# Altium project WatchX-change.PrjPCB
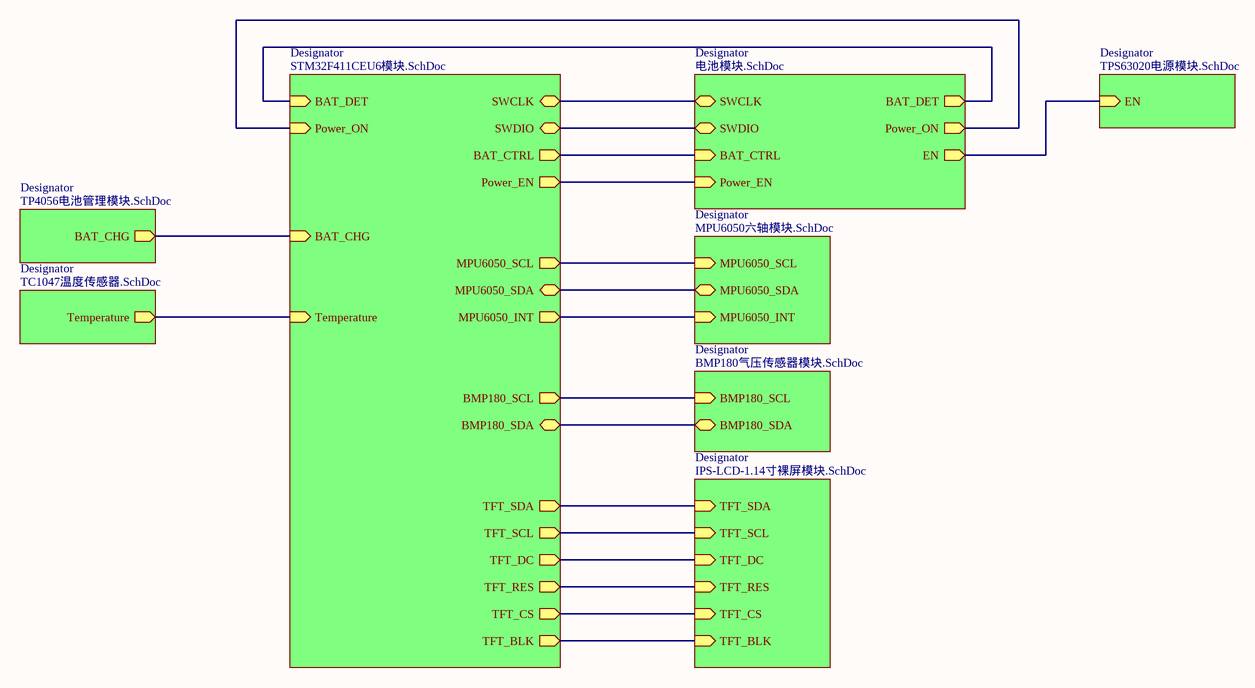
[diagram p0: WatchX-change.SchDoc]
9 sheets, 83 parts. Net scope: hierarchical (ports join the sheet entries above them; power ports are global).
Sheets:
  WatchX-change.SchDoc
    Designator = BMP180气压传感器模块.SchDoc
    Designator = IPS-LCD-1.14寸裸屏模块.SchDoc
    Designator = MPU6050六轴模块.SchDoc
    Designator = STM32F411CEU6模块.SchDoc
    Designator = TP4056电池管理模块.SchDoc
    Designator = TPS63020电源模块.SchDoc
    Designator = TC1047温度传感器.SchDoc
    Designator = 电池模块.SchDoc

## Sheet WatchX-change.SchDoc
size A4

### Sub-sheets
Designator = BMP180气压传感器模块.SchDoc: BMP180_SCL (in), BMP180_SDA (bidir)
Designator = IPS-LCD-1.14寸裸屏模块.SchDoc: TFT_SDA (in), TFT_SCL (in), TFT_DC (in), TFT_RES (in), TFT_CS (in), TFT_BLK (in)
Designator = MPU6050六轴模块.SchDoc: MPU6050_SCL (in), MPU6050_SDA (bidir), MPU6050_INT (in)
Designator = STM32F411CEU6模块.SchDoc: BMP180_SCL (out), BMP180_SDA (bidir), Temperature (in), Power_ON (in), Power_EN (out), MPU6050_SCL (out), MPU6050_SDA (bidir), MPU6050_INT (out), TFT_SDA (out), TFT_SCL (out), TFT_DC (out), TFT_RES (out), TFT_CS (out), TFT_BLK (out), BAT_DET (in), BAT_CHG (in), BAT_CTRL (out), SWCLK (bidir), SWDIO (bidir)
Designator = TP4056电池管理模块.SchDoc: BAT_CHG (out)
Designator = TPS63020电源模块.SchDoc: EN (in)
Designator = TC1047温度传感器.SchDoc: Temperature (out)
Designator = 电池模块.SchDoc: SWCLK (bidir), SWDIO (bidir), BAT_DET (out), BAT_CTRL (in), Power_ON (out), Power_EN (in), EN (out)

### Nets
BAT_CHG: sheet Designator/BAT_CHG, sheet Designator/BAT_CHG
BAT_CTRL: sheet Designator/BAT_CTRL, sheet Designator/BAT_CTRL
BAT_DET: sheet Designator/BAT_DET, sheet Designator/BAT_DET
BMP180_SCL: sheet Designator/BMP180_SCL, sheet Designator/BMP180_SCL
BMP180_SDA: sheet Designator/BMP180_SDA, sheet Designator/BMP180_SDA
EN: sheet Designator/EN, sheet Designator/EN
MPU6050_INT: sheet Designator/MPU6050_INT, sheet Designator/MPU6050_INT
MPU6050_SCL: sheet Designator/MPU6050_SCL, sheet Designator/MPU6050_SCL
MPU6050_SDA: sheet Designator/MPU6050_SDA, sheet Designator/MPU6050_SDA
Power_EN: sheet Designator/Power_EN, sheet Designator/Power_EN
Power_ON: sheet Designator/Power_ON, sheet Designator/Power_ON
SWCLK: sheet Designator/SWCLK, sheet Designator/SWCLK
SWDIO: sheet Designator/SWDIO, sheet Designator/SWDIO
Temperature: sheet Designator/Temperature, sheet Designator/Temperature
TFT_BLK: sheet Designator/TFT_BLK, sheet Designator/TFT_BLK
TFT_CS: sheet Designator/TFT_CS, sheet Designator/TFT_CS
TFT_DC: sheet Designator/TFT_DC, sheet Designator/TFT_DC
TFT_RES: sheet Designator/TFT_RES, sheet Designator/TFT_RES
TFT_SCL: sheet Designator/TFT_SCL, sheet Designator/TFT_SCL
TFT_SDA: sheet Designator/TFT_SDA, sheet Designator/TFT_SDA

## Sheet BMP180气压传感器模块.SchDoc
size A4
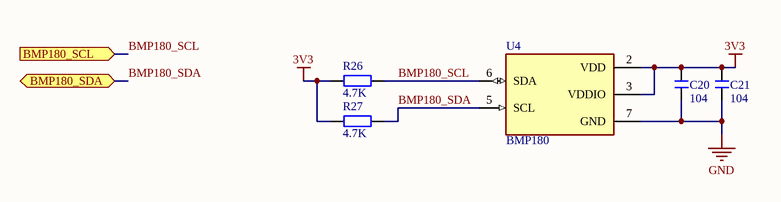
[diagram p1: BMP180气压传感器模块.SchDoc]

### Parts
C20  104  [C 0603_L]
C21  104  [C 0603_L]
R26  4.7K  [R 0603_L]
R27  4.7K  [R 0603_L]
U4  BMP180  [LGA-7]

### Ports
BMP180_SCL (in), BMP180_SDA (bidir)

### Nets
3V3: C20.2 C21.2 R26.2 R27.2 U4.2(VDD) U4.3(VDDIO)
GND: C20.1 C21.1 U4.7(GND)
BMP180_SCL: R26.1 U4.6(SDA) ; port BMP180_SCL
BMP180_SDA: R27.1 U4.5(SCL) ; port BMP180_SDA

### Library data of the parts
C20 C21 = C: 无极性贴片电容; 版权归属: 黎明电子style; BOM名称: 无极性贴片电容; 学习资源: https://lmdzstyle.taobao.com/
R26 R27 = R: 贴片电阻; 版权归属: 黎明电子style; BOM名称: 贴片电阻; 学习资源: https://lmdzstyle.taobao.com/
U4 = BMP180: 气压传感器Pressure Sensor 4.35PSI ~ 15.95PSI _30kPa ~ 110kPa_ Absolute 16 ~ 19 b 7-VLGA; MF: Bosch Sensortec; Digi-Key_Purchase_URL: https://www.digikey.com/product-detail/en/bosch-sensortec/BMP180/828-1027-1-ND/2688260?utm_source=snapeda&utm_medium=aggregator&utm_campaign=symbol; Digi-Key_Part_Number: 828-1027-1-ND; Package: VLGA-7 Bosch Sensortec; SnapEDA_Link: https://www.snapeda.com/parts/BMP180/Bosch%20Sensortec/view-part/587596/?ref=snap; Value: *; MP: BMP180

## Sheet IPS-LCD-1.14寸裸屏模块.SchDoc
size A4
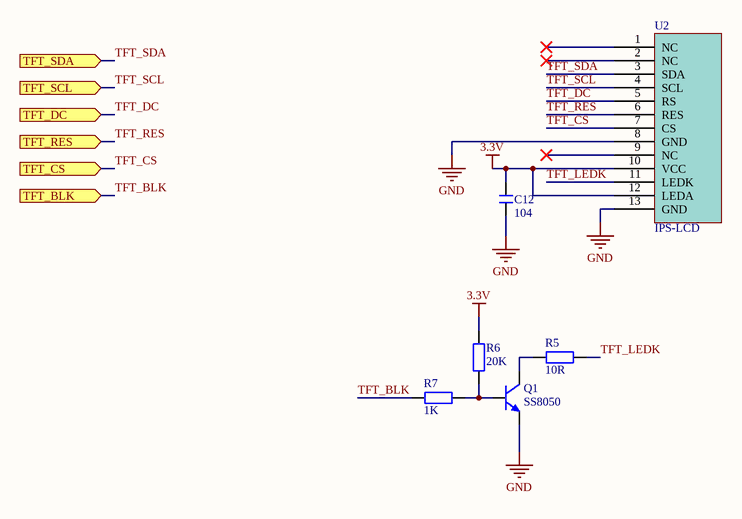
[diagram p2: IPS-LCD-1.14寸裸屏模块.SchDoc]

### Parts
C12  104  [C 0603_L]
Q1  SS8050  [SOT23-3N]
R5  10R  [R 0603_L]
R6  20K  [R 0603_L]
R7  1K  [R 0603_L]
U2  IPS-LCD  [1.14IPS-LCD]

### Ports
TFT_BLK (in), TFT_CS (in), TFT_DC (in), TFT_RES (in), TFT_SCL (in), TFT_SDA (in)

### Nets
3.3V: C12.1 R6.2 U2.10(VCC) U2.12(LEDA)
GND: C12.2 Q1.2(E) U2.8(GND) U2.13(GND)
TFT_BLK: R7.1 ; port TFT_BLK
TFT_CS: U2.7(CS) ; port TFT_CS
TFT_DC: U2.5(RS) ; port TFT_DC
TFT_LEDK: R5.1 U2.11(LEDK)
TFT_RES: U2.6(RES) ; port TFT_RES
TFT_SCL: U2.4(SCL) ; port TFT_SCL
TFT_SDA: U2.3(SDA) ; port TFT_SDA
NetQ1_1: Q1.1(B) R6.1 R7.2
NetQ1_3: Q1.3(C) R5.2

Not connected (* = marked no-connect by the designer): U2 1(NC)* 2(NC)* 9(NC)*

### Library data of the parts
C12 = C: 无极性贴片电容; 版权归属: 黎明电子style; BOM名称: 无极性贴片电容; 学习资源: https://lmdzstyle.taobao.com/
Q1 = 8050-SMD: 高频放大-NPN型 丝印J3Y; 版权归属: 源创客; 属性: 40V 1.5A 1W 100MHZ; BOM名称: 高频放大-NPN型; 学习资源: www.ooocke.com
R5-R7 = R: 贴片电阻; 版权归属: 黎明电子style; BOM名称: 贴片电阻; 学习资源: https://lmdzstyle.taobao.com/
U2 = IPS-LCD-1.14: IPS-LCD-1.14寸裸屏spi接口

## Sheet MPU6050六轴模块.SchDoc
size A4
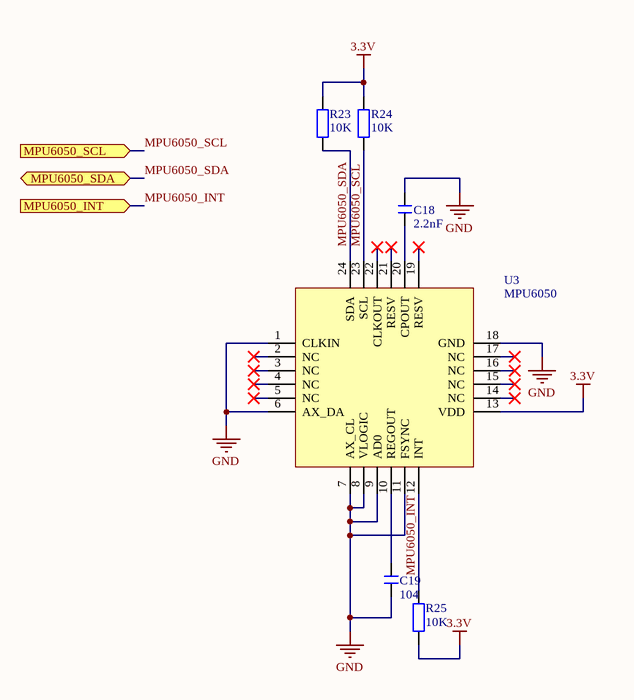
[diagram p3: MPU6050六轴模块.SchDoc]

### Parts
C18  2.2nF  [C 0603_L]
C19  104  [C 0603_L]
R23  10K  [R 0603_L]
R24  10K  [R 0603_L]
R25  10K  [R 0603_L]
U3  MPU6050  [QFN24 4x4_L]

### Ports
MPU6050_INT (in), MPU6050_SCL (in), MPU6050_SDA (bidir)

### Nets
3.3V: R23.2 R24.2 R25.1 U3.13(VDD)
GND: C18.2 C19.1 U3.1(CLKIN) U3.6(AX_DA) U3.7(AX_CL) U3.8(VLOGIC) U3.9(AD0) U3.11(FSYNC) U3.18(GND)
MPU6050_INT: R25.2 U3.12(INT) ; port MPU6050_INT
MPU6050_SCL: R24.1 U3.23(SCL) ; port MPU6050_SCL
MPU6050_SDA: R23.1 U3.24(SDA) ; port MPU6050_SDA
NetC18_1: C18.1 U3.20(CPOUT)
NetC19_2: C19.2 U3.10(REGOUT)

Not connected (* = marked no-connect by the designer): U3 2(NC)* 3(NC)* 4(NC)* 5(NC)* 14(NC)* 15(NC)* 16(NC)* 17(NC)* 19(RESV)* 21(RESV)* 22(CLKOUT)*

### Library data of the parts
C18 C19 = C: 无极性贴片电容; 版权归属: 黎明电子style; BOM名称: 无极性贴片电容; 学习资源: https://lmdzstyle.taobao.com/
R23-R25 = R: 贴片电阻; 版权归属: 黎明电子style; BOM名称: 贴片电阻; 学习资源: https://lmdzstyle.taobao.com/
U3 = MPU6050: 数字运动传感器; 版权归属: 源创客; BOM名称: 数字运动传感器; 学习资源: www.ooocke.com

## Sheet STM32F411CEU6模块.SchDoc
size A4
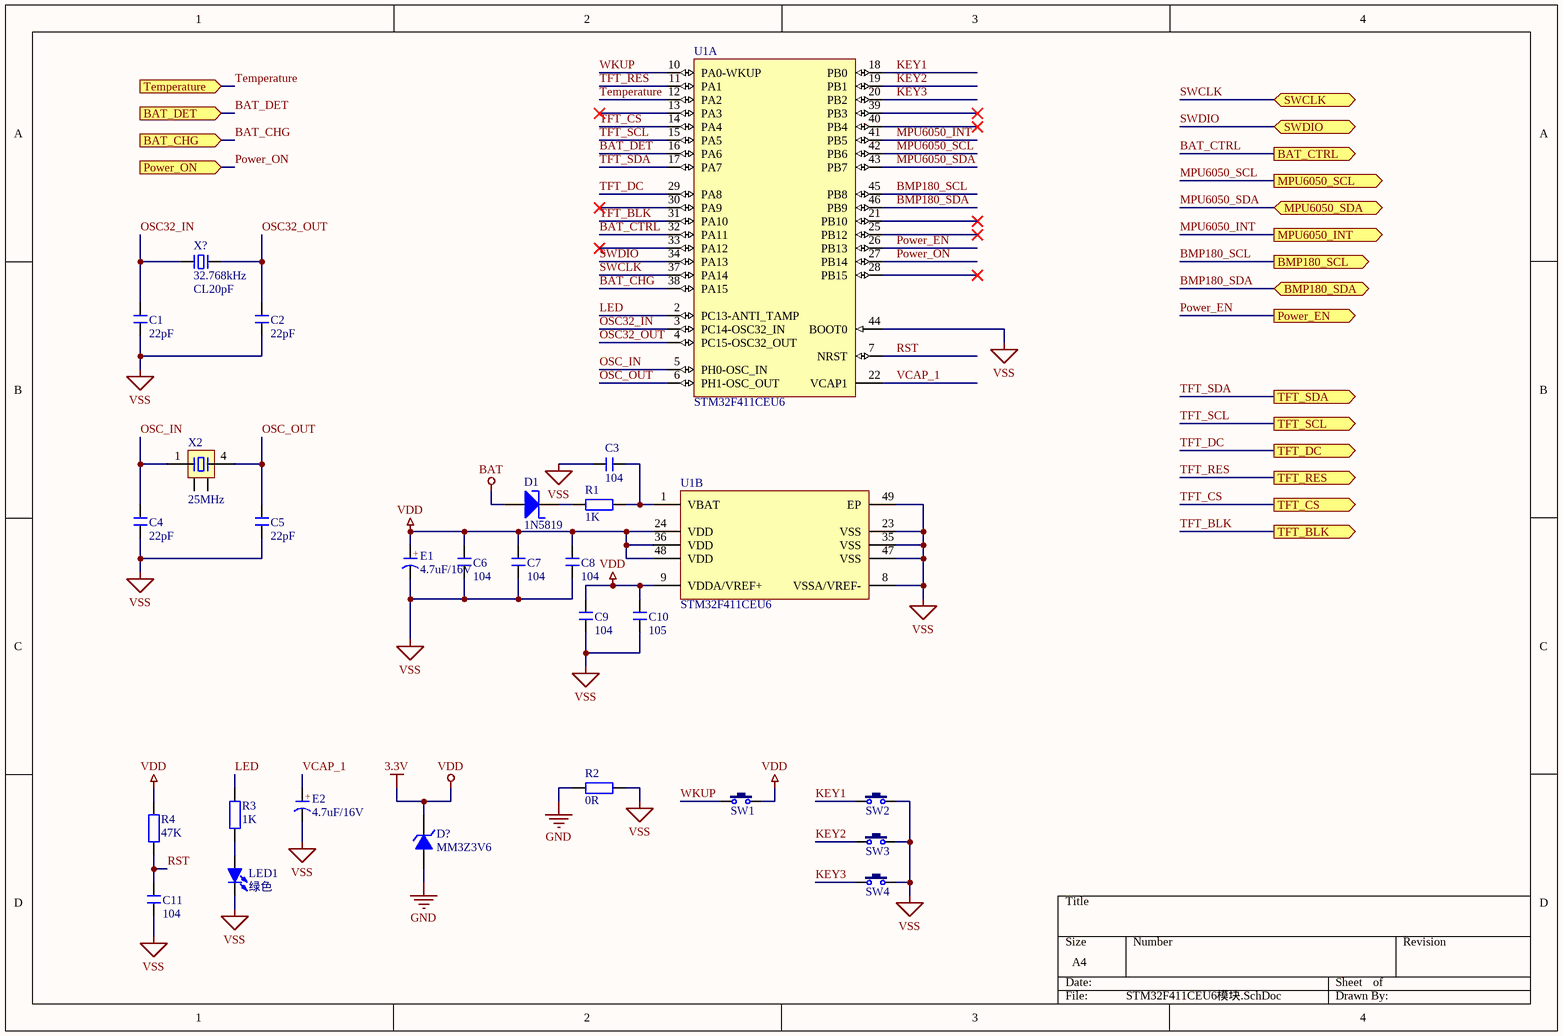
[diagram p4: STM32F411CEU6模块.SchDoc]

### Parts
C1  22pF  [C 0402_M]
C2  22pF  [C 0402_M]
C3  104  [C 0603_L]
C4  22pF  [C 0402_M]
C5  22pF  [C 0402_M]
C6  104  [C 0603_L]
C7  104  [C 0603_L]
C8  104  [C 0603_L]
C9  104  [C 0603_L]
C10  105  [C 0402_M]
C11  104  [C 0603_L]
D1  1N5819  [SOD-323]
D?  MM3Z3V6  [SOD-323]
E1  4.7uF/16V  [CD A(3216)]
E2  4.7uF/16V  [CD A(3216)]
LED1  绿色  [LED 0603G]
R1  1K  [R 0603_L]
R2  0R  [R 0603_L]
R3  1K  [R 0603_L]
R4  47K  [R 0603_L]
SW1  3x6x5  [TSW 3*6*4.3-S-W]  (value not drawn)
SW2  3x6x5  [TSW 3*6*4.3-S-W]  (value not drawn)
SW3  3x6x5  [TSW 3*6*4.3-S-W]  (value not drawn)
SW4  3x6x5  [TSW 3*6*4.3-S-W]  (value not drawn)
U1  STM32F411CEU6  [QFN48 7X7_N]  (parts A,B of 2)
X2  25MHz  [OSC 1612-4P]
X?  32.768kHz  负载电容: CL20pF  [OSC 1016-2P]

### Ports
BAT_CHG (in), BAT_CTRL (out), BAT_DET (in), BMP180_SCL (out), BMP180_SDA (bidir), MPU6050_INT (out), MPU6050_SCL (out), MPU6050_SDA (bidir), Power_EN (out), Power_ON (in), SWCLK (bidir), SWDIO (bidir), Temperature (in), TFT_BLK (out), TFT_CS (out), TFT_DC (out), TFT_RES (out), TFT_SCL (out), TFT_SDA (out)

### Nets
3.3V: C6.2 C7.2 C8.2 C9.2 C10.2 D?.2(K) E1.1(A) R4.2 SW1.2 U1.9(VDDA/VREF+) U1.24(VDD) U1.36(VDD) U1.48(VDD)  [also labelled VDD]
BAT: D1.1(A)
GND: D?.1(A) R2.2
VSS: C1.1 C2.1 C3.2 C4.1 C5.1 C6.1 C7.1 C8.1 C9.1 C10.1 C11.1 E1.2(K) E2.2(K) LED1.2(K) R2.1 SW2.2 SW3.2 SW4.2 U1.8(VSSA/VREF-) U1.23(VSS) U1.35(VSS) U1.44(BOOT0) U1.47(VSS) U1.49(EP)
BAT_CHG: U1.38(PA15) ; port BAT_CHG
BAT_CTRL: U1.32(PA11) ; port BAT_CTRL
BAT_DET: U1.16(PA6) ; port BAT_DET
BMP180_SCL: U1.45(PB8) ; port BMP180_SCL
BMP180_SDA: U1.46(PB9) ; port BMP180_SDA
KEY1: SW2.1 U1.18(PB0)
KEY2: SW3.1 U1.19(PB1)
KEY3: SW4.1 U1.20(PB2)
LED: R3.2 U1.2(PC13-ANTI_TAMP)
MPU6050_INT: U1.41(PB5) ; port MPU6050_INT
MPU6050_SCL: U1.42(PB6) ; port MPU6050_SCL
MPU6050_SDA: U1.43(PB7) ; port MPU6050_SDA
OSC32_IN: C1.2 U1.3(PC14-OSC32_IN) X?.1
OSC32_OUT: C2.2 U1.4(PC15-OSC32_OUT) X?.2
OSC_IN: C4.2 U1.5(PH0-OSC_IN) X2.1
OSC_OUT: C5.2 U1.6(PH1-OSC_OUT) X2.4
Power_EN: U1.26(PB13) ; port Power_EN
Power_ON: U1.27(PB14) ; port Power_ON
RST: C11.2 R4.1 U1.7(NRST)
SWCLK: U1.37(PA14) ; port SWCLK
SWDIO: U1.34(PA13) ; port SWDIO
Temperature: U1.12(PA2) ; port Temperature
TFT_BLK: U1.31(PA10) ; port TFT_BLK
TFT_CS: U1.14(PA4) ; port TFT_CS
TFT_DC: U1.29(PA8) ; port TFT_DC
TFT_RES: U1.11(PA1) ; port TFT_RES
TFT_SCL: U1.15(PA5) ; port TFT_SCL
TFT_SDA: U1.17(PA7) ; port TFT_SDA
VCAP_1: E2.1(A) U1.22(VCAP1)
WKUP: SW1.1 U1.10(PA0-WKUP)
NetC3_1: C3.1 R1.2 U1.1(VBAT)
NetD1_2: D1.2(K) R1.1
NetLED1_1: LED1.1(A) R3.1

Not connected (* = marked no-connect by the designer): U1 13(PA3)* 21(PB10)* 25(PB12)* 28(PB15)* 30(PA9)* 33(PA12)* 39(PB3)* 40(PB4)*; X2 2 3

### Notes on the sheet
- (in symbol C-CD) +

### Library data of the parts
C1-C11 = C: 无极性贴片电容; 版权归属: 黎明电子style; BOM名称: 无极性贴片电容; 学习资源: https://lmdzstyle.taobao.com/
D1 = 1N5819: 肖特基二极管; 版权归属: 源创客; 属性: 40V/2A; BOM名称: 肖特基二极管; 学习资源: www.ooocke.com
D? = MM3Z3V6: 3.6V/0.3W稳压管
E1 E2 = C-CD: 贴片钽电容; 版权归属: 黎明电子style; BOM名称: 贴片钽电容; 学习资源: https://lmdzstyle.taobao.com/
LED1 = LED-SMD: 贴片LED; 版权归属: 源创客; BOM名称: 贴片LED; 学习资源: www.ooocke.com
R1-R4 = R: 贴片电阻; 版权归属: 黎明电子style; BOM名称: 贴片电阻; 学习资源: https://lmdzstyle.taobao.com/
SW1-SW4 = TSW 3x6: 3x6轻触开关; 版权归属: 源创客; BOM名称: 3x6轻触开关; 学习资源: www.ooocke.com
U1 = STM32F411CEU6: ARM Cortex-M4 32-bit MCU+FPU, 105 DMIPS, 256 kB Flash, 64 kB Internal RAM, 36 I/Os, 48-pin UFQFPN, -40 to 85 degC, Tray; Manufacturer: STMicroelectronics; PartNumber: STM32F401CCU6; FLASH Size (Prog) (kB): 256; I/Os (High Current): 36; Internal RAM Size (kB): 64; Operating Frequency(F) (Processor speed) (MHz): 84; Supply Voltage(Vcc) max (V): 3.6; Supply Voltage(Vcc) min (V): 1.8; DatasheetVersion: Rev. 1; PackageVersion: Rev. 1, 04/2013; PackageReference: UFQFPN48; PackageDescription: 48-Pin Ultra Thin Fine Pitch Quad Flat No-Lead, 7 x 7 x 0.6 mm Body, 0.5 mm Pitch, Exposed Pad; Supplier 1: Newark; Supplier Part Number 1: 19X6217; Supplier 2: Mouser; Supplier Part Number 2: 511-STM32F401CCU6; Core: ARM Cortex-M4; Packing: Tray; Mounting Technology: Surface Mount; ComponentLink1Description: Manufacturer URL; ComponentLink1URL: http://www.st.com/web/en/home.html; ComponentLink2Description: Datasheet; ComponentLink2URL: http://www.st.com/st-web-ui/static/active/en/resource/technical/document/data_brief/DM00071938.pdf; ComponentLink3Description: Package Specification; ComponentLink3URL: http://www.st.com/st-web-ui/static/active/en/resource/technical/document/data_brief/DM00071938.pdf
X2 = XTAL-MC-4P: MC系列4脚晶振; BOM名称: 2脚无源脚晶振; 版权归属: 源创客; 学习资源: www.ooocke.com
X? = XTAL-2P: 2脚无源脚晶振; 版权归属: 源创客; BOM名称: 2脚无源脚晶振; 学习资源: www.ooocke.com

## Sheet TP4056电池管理模块.SchDoc
size A4
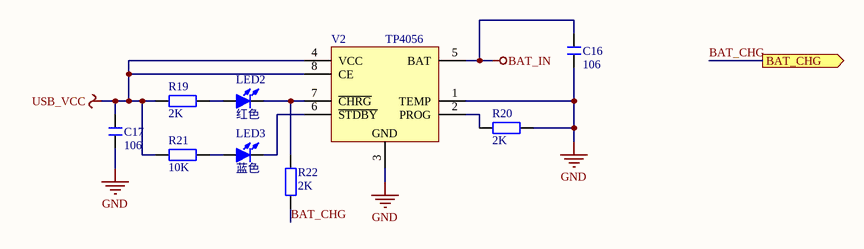
[diagram p5: TP4056电池管理模块.SchDoc]

### Parts
C16  106  [C 0603_L]
C17  106  [C 0603_L]
LED2  红色  [LED 0603R]
LED3  蓝色  [LED 0603B]
R19  2K  [R 0603_L]
R20  2K  [R 0603_L]
R21  10K  [R 0603_L]
R22  2K  [R 0603_L]
V2  TP4056  [SOP8_L]

### Ports
BAT_CHG (out)

### Nets
BAT_IN: C16.1 V2.5(BAT)  [project net BAT]
GND: C16.2 C17.1 R20.1 V2.1(TEMP) V2.3(GND)
USB_VCC: C17.2 R19.2 R21.2 V2.4(VCC) V2.8(CE)
BAT_CHG: R22.2 ; port BAT_CHG
NetLED2_1: LED2.1(A) R19.1
NetLED2_2: LED2.2(K) R22.1 V2.7(~{CHRG})
NetLED3_1: LED3.1(A) R21.1
NetLED3_2: LED3.2(K) V2.6(~{STDBY})
NetR20_2: R20.2 V2.2(PROG)

### Library data of the parts
C16 C17 = C: 无极性贴片电容; 版权归属: 黎明电子style; BOM名称: 无极性贴片电容; 学习资源: https://lmdzstyle.taobao.com/
LED2 LED3 = LED-SMD: 贴片LED; 版权归属: 源创客; BOM名称: 贴片LED; 学习资源: www.ooocke.com
R19-R22 = R: 贴片电阻; 版权归属: 黎明电子style; BOM名称: 贴片电阻; 学习资源: https://lmdzstyle.taobao.com/
V2 = TP4056: 锂电池充电管理; 版权归属: 源创客; BOM名称: 锂电池充电管理; 学习资源: www.ooocke.com

## Sheet TPS63020电源模块.SchDoc
size A4
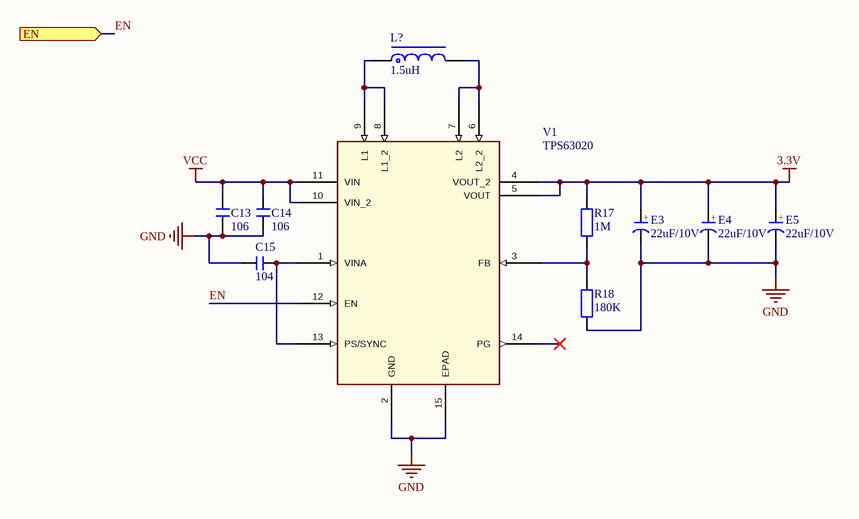
[diagram p6: TPS63020电源模块.SchDoc]

### Parts
C13  106  [C 0603_L]
C14  106  [C 0603_L]
C15  104  [C 0603_L]
E3  22uF/10V  [CD A(3216)]
E4  22uF/10V  [CD A(3216)]
E5  22uF/10V  [CD A(3216)]
L?  1.5uH  [SMD,4.75x4.45x2mm]
R17  1M  [R 0603_L]
R18  180K  [R 0603_L]
V1  TPS63020  [VSON - 14]

### Ports
EN (in)

### Nets
3.3V: E3.1(A) E4.1(A) E5.1(A) R17.2 V1.4(VOUT_2) V1.5(VOUT)
GND: C13.2 C14.2 C15.1 E3.2(K) E4.2(K) E5.2(K) R18.1 V1.2(GND) V1.15(EPAD)
VCC: C13.1 C14.1 V1.10(VIN_2) V1.11(VIN)
EN: V1.12(EN) ; port EN
NetC15_2: C15.2 V1.1(VINA) V1.13(PS/SYNC)
NetL?_1: L?.1 V1.8(L1_2) V1.9(L1)
NetL?_2: L?.2 V1.6(L2_2) V1.7(L2)
NetR17_1: R17.1 R18.2 V1.3(FB)

Not connected (* = marked no-connect by the designer): V1 14(PG)*

### Notes on the sheet
- (in symbol C-CD) +

### Library data of the parts
C13-C15 = C: 无极性贴片电容; 版权归属: 黎明电子style; BOM名称: 无极性贴片电容; 学习资源: https://lmdzstyle.taobao.com/
E3-E5 = C-CD: 贴片钽电容; 版权归属: 黎明电子style; BOM名称: 贴片钽电容; 学习资源: https://lmdzstyle.taobao.com/
L? = L-CD: 贴片功率电感; BOM名称: 功率电感; 版权归属: 黎明电子style; 学习资源: https://lmdzstyle.taobao.com/
R17 R18 = R: 贴片电阻; 版权归属: 黎明电子style; BOM名称: 贴片电阻; 学习资源: https://lmdzstyle.taobao.com/
V1 = TPS63020: 单电感器降压/升压转换器   High Efficiency Single Inductor Buck-Boost Converter with 4A Switch

## Sheet TC1047温度传感器.SchDoc
size A4
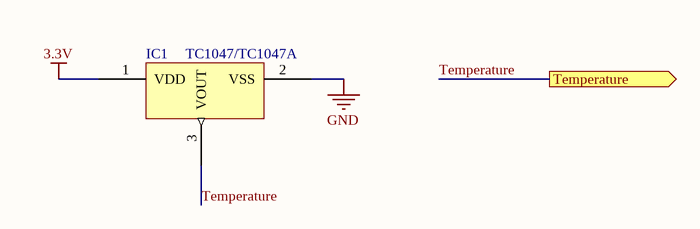
[diagram p7: TC1047温度传感器.SchDoc]

### Parts
IC1  TC1047/TC1047A  [SOT23-3L]

### Ports
Temperature (out)

### Nets
3.3V: IC1.1(VDD)
GND: IC1.2(VSS)
Temperature: IC1.3(VOUT) ; port Temperature

### Library data of the parts
IC1 = TC1047/TC1047A: 温度传感器 温度=(电压-500mV)÷10，测温范围-40℃~125℃

## Sheet 电池模块.SchDoc
size A4
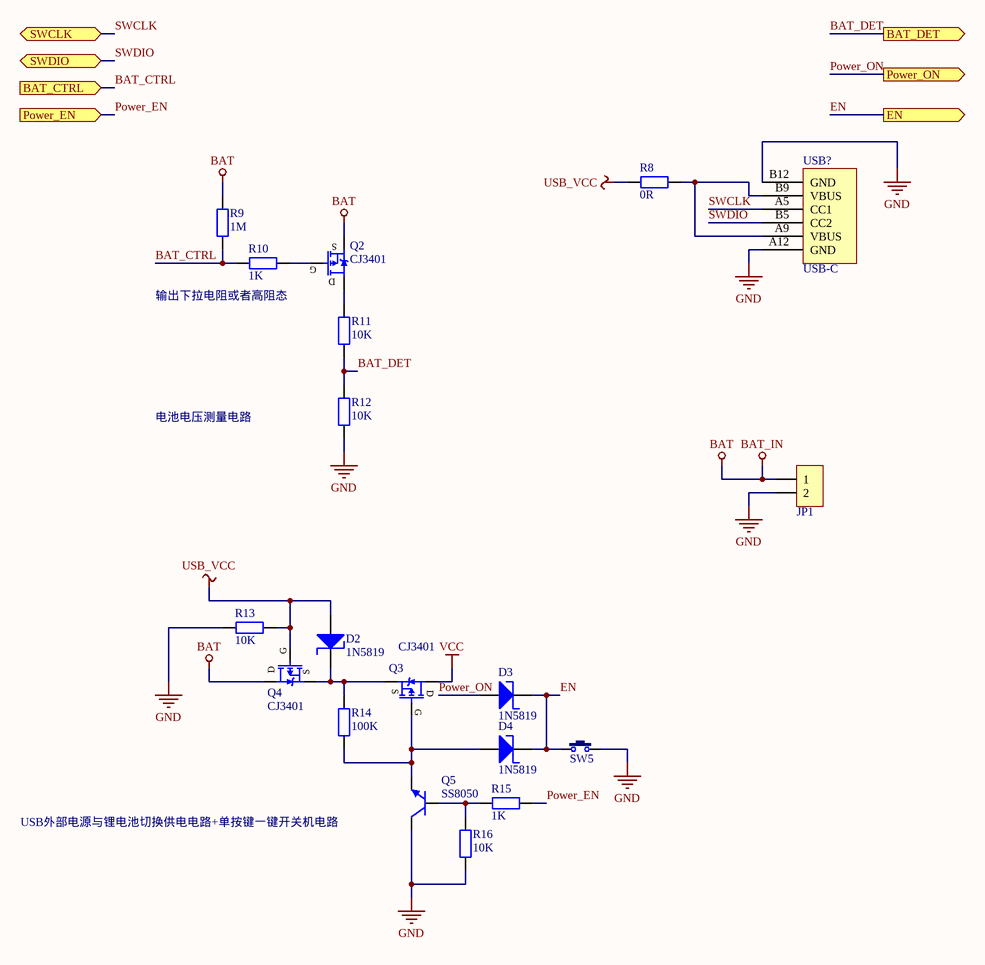
[diagram p8: 电池模块.SchDoc]

### Parts
D2  1N5819  [SOD-323]
D3  1N5819  [SOD-323]
D4  1N5819  [SOD-323]
JP1  HDR-1X2  [HDR2.54-LI-2P]  (value not drawn)
Q2  CJ3401  [SOT23-3L]
Q3  CJ3401  [SOT23-3L]
Q4  CJ3401  [SOT23-3L]
Q5  SS8050  [SOT23-3N]
R8  0R  [R 0603_L]
R9  1M  [R 0603_L]
R10  1K  [R 0603_L]
R11  10K  [R 0603_L]
R12  10K  [R 0603_L]
R13  10K  [R 0603_L]
R14  100K  [R 0603_L]
R15  1K  [R 0603_L]
R16  10K  [R 0603_L]
SW5  3x6x5  [TSW 3*6*4.3-S-W]  (value not drawn)
USB?  USB-C  [USB-C/S_C]

### Ports
BAT_CTRL (in), BAT_DET (out), EN (out), Power_EN (in), Power_ON (out), SWCLK (bidir), SWDIO (bidir)

### Nets
BAT: JP1.1 Q2.3(D) Q4.2(S) R9.1  [also labelled BAT_IN]
GND: JP1.2 Q5.3(C) R12.2 R13.2 R16.2 SW5.2 USB?.A12(GND) USB?.B12(GND)
USB_VCC: D2.1(A) Q4.1(G) R8.2 R13.1
VCC: Q3.2(S)
BAT_CTRL: R9.2 R10.1 ; port BAT_CTRL
BAT_DET: R11.2 R12.1 ; port BAT_DET
EN: D3.2(K) D4.2(K) SW5.1 ; port EN
Power_EN: R15.2 ; port Power_EN
Power_ON: D3.1(A) ; port Power_ON
SWCLK: USB?.A5(CC1) ; port SWCLK
SWDIO: USB?.B5(CC2) ; port SWDIO
NetD2_2: D2.2(K) Q3.3(D) Q4.3(D) R14.1
NetD4_1: D4.1(A) Q3.1(G) Q5.2(E) R14.2
NetQ2_1: Q2.1(G) R10.2
NetQ2_2: Q2.2(S) R11.1
NetQ5_1: Q5.1(B) R15.1 R16.1
NetR8_1: R8.1 USB?.A9(VBUS) USB?.B9(VBUS)

### Notes on the sheet
- 输出下拉电阻或者高阻态
- 电池电压测量电路
- USB外部电源与锂电池切换供电电路+单按键一键开关机电路

### Library data of the parts
D2-D4 = 1N5819: 肖特基二极管; 版权归属: 源创客; 属性: 40V/2A; BOM名称: 肖特基二极管; 学习资源: www.ooocke.com
JP1 = Header 2: 2P接插件; 版权归属: 源创客; BOM名称: 2P接插件; 学习资源: www.ooocke.com
Q2-Q4 = CJ3401: P沟道 30V/4.2A
Q5 = 8050-SMD: as Q1 on sheet IPS-LCD-1.14寸裸屏模块; BOM名称: 高频放大-NPN型; 学习资源: www.ooocke.com
R8-R16 = R: 贴片电阻; 版权归属: 黎明电子style; BOM名称: 贴片电阻; 学习资源: https://lmdzstyle.taobao.com/
SW5 = TSW 3x6: 3x6轻触开关; 版权归属: 源创客; BOM名称: 3x6轻触开关; 学习资源: www.ooocke.com
USB? = USB-C_6P/S: USB-C_6P型母接口; BOM名称: USB-C型母接口; 版权归属: 源创客; 学习资源: www.ooocke.com

## Nets that join several sheets
3.3V: IPS-LCD-1.14寸裸屏模块 (C12.1 R6.2 U2.10 U2.12), MPU6050六轴模块 (R23.2 R24.2 R25.1 U3.13), STM32F411CEU6模块 (13 pins), TPS63020电源模块 (6 pins), TC1047温度传感器 (IC1.1)
BAT: STM32F411CEU6模块 (D1.1), TP4056电池管理模块 (C16.1 V2.5), 电池模块 (JP1.1 Q2.3 Q4.2 R9.1)
GND: BMP180气压传感器模块 (C20.1 C21.1 U4.7), IPS-LCD-1.14寸裸屏模块 (C12.2 Q1.2 U2.8 U2.13), MPU6050六轴模块 (9 pins), STM32F411CEU6模块 (D?.1 R2.2), TP4056电池管理模块 (5 pins), TPS63020电源模块 (9 pins), TC1047温度传感器 (IC1.2), 电池模块 (8 pins)
USB_VCC: TP4056电池管理模块 (5 pins), 电池模块 (D2.1 Q4.1 R8.2 R13.1)
VCC: TPS63020电源模块 (C13.1 C14.1 V1.10 V1.11), 电池模块 (Q3.2)
BAT_CHG: STM32F411CEU6模块 (U1.38), TP4056电池管理模块 (R22.2)
BAT_CTRL: STM32F411CEU6模块 (U1.32), 电池模块 (R9.2 R10.1)
BAT_DET: STM32F411CEU6模块 (U1.16), 电池模块 (R11.2 R12.1)
BMP180_SCL: BMP180气压传感器模块 (R26.1 U4.6), STM32F411CEU6模块 (U1.45)
BMP180_SDA: BMP180气压传感器模块 (R27.1 U4.5), STM32F411CEU6模块 (U1.46)
EN: TPS63020电源模块 (V1.12), 电池模块 (D3.2 D4.2 SW5.1)
MPU6050_INT: MPU6050六轴模块 (R25.2 U3.12), STM32F411CEU6模块 (U1.41)
MPU6050_SCL: MPU6050六轴模块 (R24.1 U3.23), STM32F411CEU6模块 (U1.42)
MPU6050_SDA: MPU6050六轴模块 (R23.1 U3.24), STM32F411CEU6模块 (U1.43)
Power_EN: STM32F411CEU6模块 (U1.26), 电池模块 (R15.2)
Power_ON: STM32F411CEU6模块 (U1.27), 电池模块 (D3.1)
SWCLK: STM32F411CEU6模块 (U1.37), 电池模块 (USB?.A5)
SWDIO: STM32F411CEU6模块 (U1.34), 电池模块 (USB?.B5)
Temperature: STM32F411CEU6模块 (U1.12), TC1047温度传感器 (IC1.3)
TFT_BLK: IPS-LCD-1.14寸裸屏模块 (R7.1), STM32F411CEU6模块 (U1.31)
TFT_CS: IPS-LCD-1.14寸裸屏模块 (U2.7), STM32F411CEU6模块 (U1.14)
TFT_DC: IPS-LCD-1.14寸裸屏模块 (U2.5), STM32F411CEU6模块 (U1.29)
TFT_RES: IPS-LCD-1.14寸裸屏模块 (U2.6), STM32F411CEU6模块 (U1.11)
TFT_SCL: IPS-LCD-1.14寸裸屏模块 (U2.4), STM32F411CEU6模块 (U1.15)
TFT_SDA: IPS-LCD-1.14寸裸屏模块 (U2.3), STM32F411CEU6模块 (U1.17)